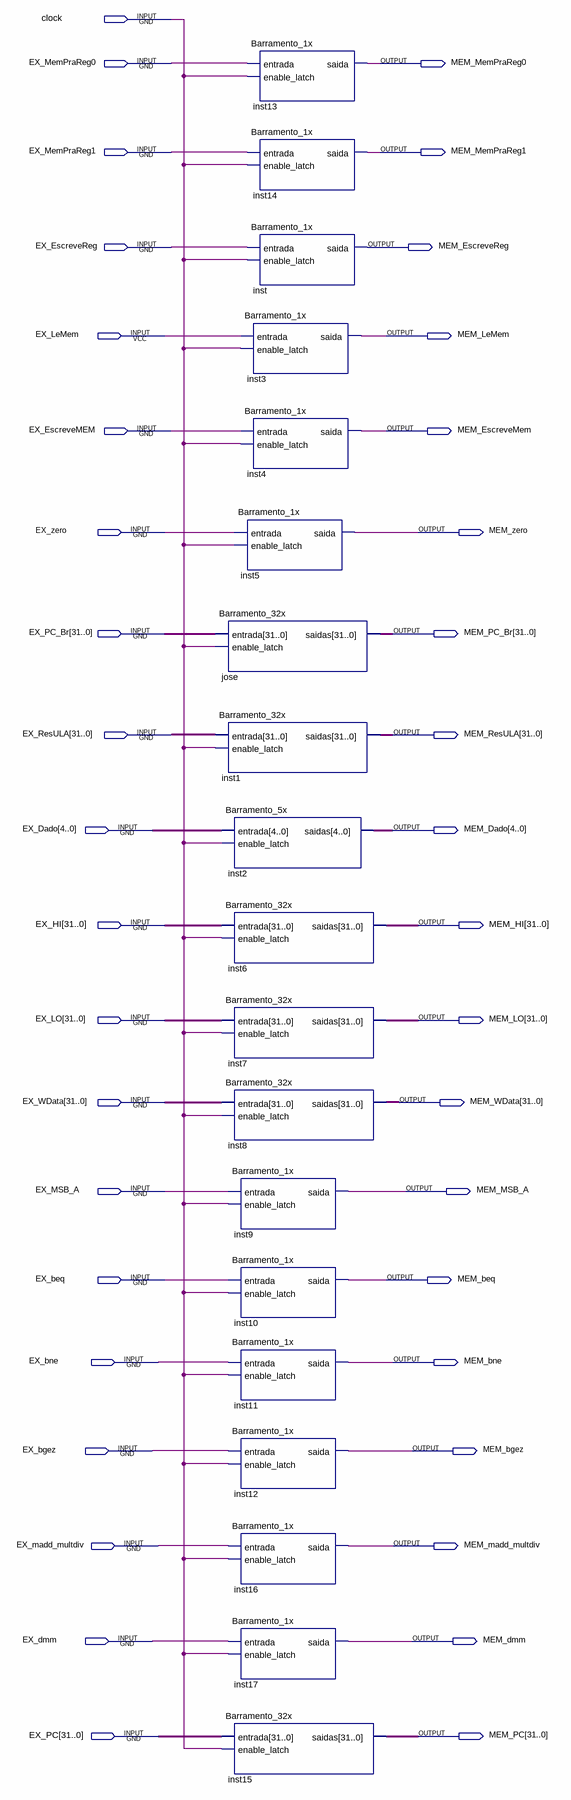
[diagram p0: schematic sheet]
// Quartus schematic EX_MEM.bdf as structural Verilog: 19 symbols, 39 pins
module EX_MEM (
  input  clock,
  input  EX_MemPraReg0,
  input  EX_MemPraReg1,
  input  EX_EscreveReg,
  input  EX_LeMem,
  input  EX_EscreveMEM,
  input  EX_zero,
  input  [31:0] EX_PC_Br,
  input  [31:0] EX_ResULA,
  input  [4:0] EX_Dado,
  input  [31:0] EX_HI,
  input  [31:0] EX_LO,
  input  [31:0] EX_WData,
  input  EX_MSB_A,
  input  EX_beq,
  input  EX_bne,
  input  EX_bgez,
  input  EX_madd_multdiv,
  input  EX_dmm,
  input  [31:0] EX_PC,
  output MEM_MemPraReg0,
  output MEM_MemPraReg1,
  output MEM_EscreveReg,
  output MEM_LeMem,
  output MEM_EscreveMem,
  output MEM_zero,
  output [31:0] MEM_PC_Br,
  output [31:0] MEM_ResULA,
  output [4:0] MEM_Dado,
  output [31:0] MEM_HI,
  output [31:0] MEM_LO,
  output [31:0] MEM_WData,
  output MEM_MSB_A,
  output MEM_beq,
  output MEM_bne,
  output MEM_bgez,
  output MEM_madd_multdiv,
  output MEM_dmm,
  output [31:0] MEM_PC
);

  Barramento_1x inst13 (.entrada(EX_MemPraReg0), .enable_latch(clock), .saida(MEM_MemPraReg0));
  Barramento_1x inst14 (.entrada(EX_MemPraReg1), .enable_latch(clock), .saida(MEM_MemPraReg1));
  Barramento_1x inst (.entrada(EX_EscreveReg), .enable_latch(clock), .saida(MEM_EscreveReg));
  Barramento_1x inst3 (.entrada(EX_LeMem), .enable_latch(clock), .saida(MEM_LeMem));
  Barramento_1x inst4 (.entrada(EX_EscreveMEM), .enable_latch(clock), .saida(MEM_EscreveMem));
  Barramento_1x inst5 (.entrada(EX_zero), .enable_latch(clock), .saida(MEM_zero));
  Barramento_32x jose (.entrada(EX_PC_Br), .enable_latch(clock), .saidas(MEM_PC_Br));
  Barramento_32x inst1 (.entrada(EX_ResULA), .enable_latch(clock), .saidas(MEM_ResULA));
  Barramento_5x inst2 (.entrada(EX_Dado), .enable_latch(clock), .saidas(MEM_Dado));
  Barramento_32x inst6 (.entrada(EX_HI), .enable_latch(clock), .saidas(MEM_HI));
  Barramento_32x inst7 (.entrada(EX_LO), .enable_latch(clock), .saidas(MEM_LO));
  Barramento_32x inst8 (.entrada(EX_WData), .enable_latch(clock), .saidas(MEM_WData));
  Barramento_1x inst9 (.entrada(EX_MSB_A), .enable_latch(clock), .saida(MEM_MSB_A));
  Barramento_1x inst10 (.entrada(EX_beq), .enable_latch(clock), .saida(MEM_beq));
  Barramento_1x inst11 (.entrada(EX_bne), .enable_latch(clock), .saida(MEM_bne));
  Barramento_1x inst12 (.entrada(EX_bgez), .enable_latch(clock), .saida(MEM_bgez));
  Barramento_1x inst16 (.entrada(EX_madd_multdiv), .enable_latch(clock), .saida(MEM_madd_multdiv));
  Barramento_1x inst17 (.entrada(EX_dmm), .enable_latch(clock), .saida(MEM_dmm));
  Barramento_32x inst15 (.entrada(EX_PC), .enable_latch(clock), .saidas(MEM_PC));
endmodule
